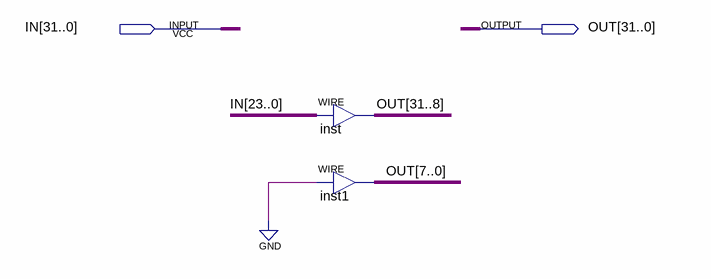
[diagram p0: schematic sheet]
// Quartus schematic SLL8.bdf as structural Verilog: 2 symbols, 2 pins
module SLL8 (
  input  [31:0] IN,
  output [31:0] OUT
);

  assign OUT[31:8] = IN[23:0];  // WIRE inst
  assign OUT[7:0] = {8{1'b0}};  // WIRE inst1
endmodule
